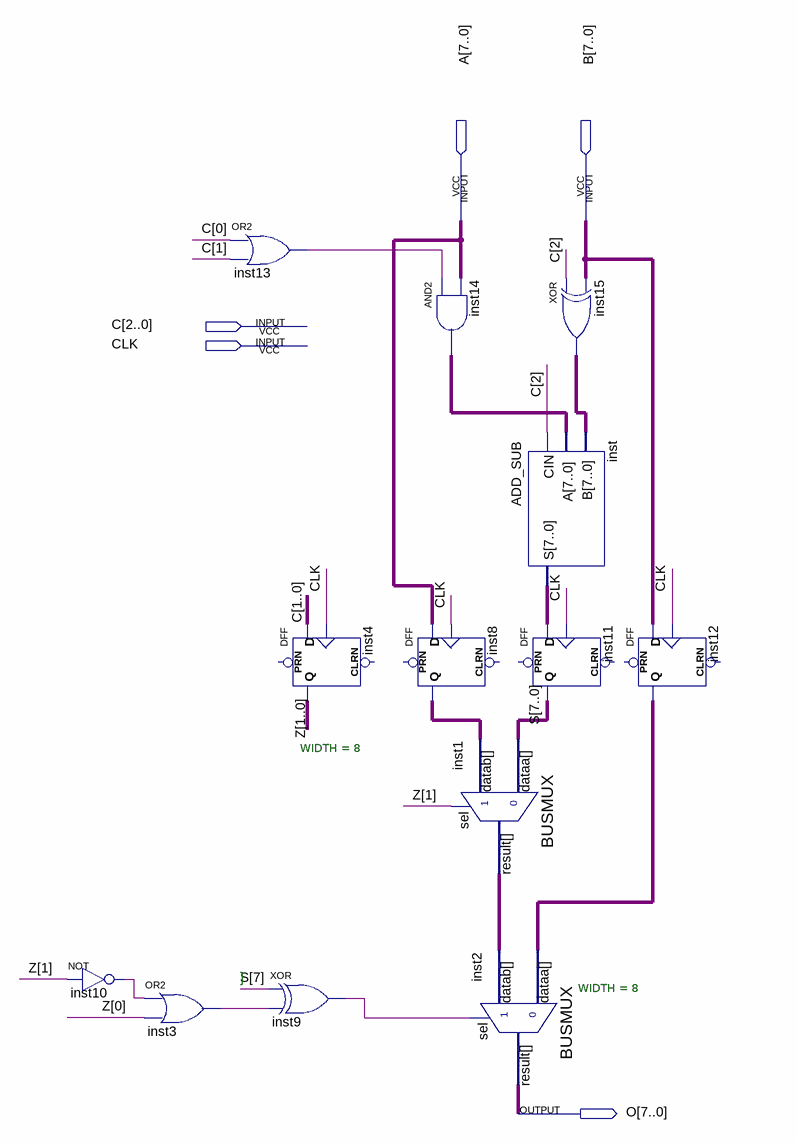
[diagram p0: schematic sheet]
// Quartus schematic ALU.bdf as structural Verilog: 13 symbols, 5 pins
module ALU (
  input  [7:0] A,
  input  [7:0] B,
  input  [2:0] C,
  input  CLK,
  output [7:0] O
);

  wire inst3_out, inst9_out, inst10_out, inst13_out;
  wire [1:0] Z;
  wire [7:0] inst1_result, inst8_q, inst12_q, inst14_out, inst15_out, inst_s, S;

  not inst10 (inst10_out, Z[1]);
  or inst3 (inst3_out, inst10_out, Z[0]);
  or inst13 (inst13_out, C[0], C[1]);
  DFF inst4[1:0] (.CLK(CLK), .D(C[1:0]), .Q(Z));  // open: CLRN, PRN
  xor inst9 (inst9_out, S[7], inst3_out);
  assign inst14_out = {8{inst13_out}} & A;  // AND2 inst14, 8 bits wide
  DFF inst8[7:0] (.CLK(CLK), .D(A), .Q(inst8_q));  // open: CLRN, PRN
  ADD_SUB inst (.CIN(C[2]), .A(inst14_out), .B(inst15_out), .S(inst_s));
  BUSMUX #(.WIDTH(8)) inst1 (.datab(inst8_q), .sel(Z[1]), .dataa(S), .result(inst1_result));
  BUSMUX #(.WIDTH(8)) inst2 (.datab(inst1_result), .sel(inst9_out), .dataa(inst12_q), .result(O));
  assign inst15_out = {8{C[2]}} ^ B;  // XOR inst15, 8 bits wide
  DFF inst11[7:0] (.CLK(CLK), .D(inst_s), .Q(S));  // open: CLRN, PRN
  DFF inst12[7:0] (.CLK(CLK), .D(B), .Q(inst12_q));  // open: CLRN, PRN

  // Notes on the sheet:
  //   ]
endmodule
